# Altium project hexbot_LED.PrjPcb
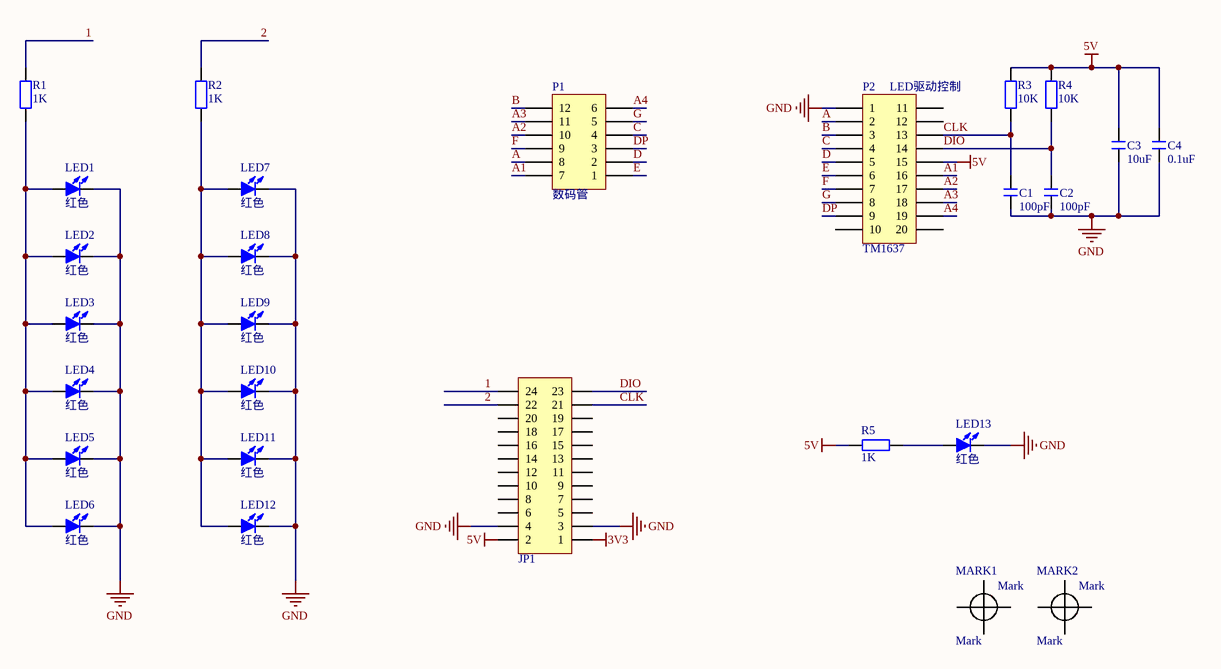
[diagram p0: hexbot_LED.SchDoc]
1 sheet, 27 parts. Net scope: global (net labels, ports and power ports of the same name join across sheets).
Board file: hexbot_LED.PcbDoc

## Sheet hexbot_LED.SchDoc
size A4

### Parts
C1  100pF  [C 0603_L]
C2  100pF  [C 0603_L]
C3  10uF  [C 0603_L]
C4  0.1uF  [C 0603_L]
JP1  Header 2X11  [HDR2.54-WI-2x12P]  (value not drawn)
LED1  红色  [LED 0603R]
LED2  红色  [LED 0603R]
LED3  红色  [LED 0603R]
LED4  红色  [LED 0603R]
LED5  红色  [LED 0603R]
LED6  红色  [LED 0603R]
LED7  红色  [LED 0603R]
LED8  红色  [LED 0603R]
LED9  红色  [LED 0603R]
LED10  红色  [LED 0603R]
LED11  红色  [LED 0603R]
LED12  红色  [LED 0603R]
LED13  红色  [LED 0603R]
MARK1  Mark  [Mark]  (no BOM)
MARK2  Mark  [Mark]  (no BOM)
P1  数码管  [数码管]
P2  TM1637  [TM1637封装]
R1  1K  [R 0603_L]
R2  1K  [R 0603_L]
R3  10K  [R 0603_L]
R4  10K  [R 0603_L]
R5  1K  [R 0603_L]

### Nets
3V3: JP1.1
5V: C3.2 C4.2 JP1.2 P2.15 R3.2 R4.2 R5.2
GND: C1.1 C2.1 C3.1 C4.1 JP1.3 JP1.4 LED1.2(K) LED2.2(K) LED3.2(K) LED4.2(K) LED5.2(K) LED6.2(K) LED7.2(K) LED8.2(K) LED9.2(K) LED10.2(K) LED11.2(K) LED12.2(K) LED13.2(K) P2.1
1: JP1.24 R1.2
2: JP1.22 R2.2
A: P1.8 P2.2
A1: P1.7 P2.16
A2: P1.10 P2.17
A3: P1.11 P2.18
A4: P1.6 P2.19
B: P1.12 P2.3
C: P1.4 P2.4
CLK: C1.2 JP1.21 P2.13 R3.1
D: P1.2 P2.5
DIO: C2.2 JP1.23 P2.14 R4.1
DP: P1.3 P2.9
E: P1.1 P2.6
F: P1.9 P2.7
G: P1.5 P2.8
NetLED1_1: LED1.1(A) LED2.1(A) LED3.1(A) LED4.1(A) LED5.1(A) LED6.1(A) R1.1
NetLED7_1: LED7.1(A) LED8.1(A) LED9.1(A) LED10.1(A) LED11.1(A) LED12.1(A) R2.1
NetLED13_1: LED13.1(A) R5.1

Not connected (* = marked no-connect by the designer): JP1 5 6 7 8 9 10 11 12 13 14 15 16 17 18 19 20; P2 10 11 12 20

### Notes on the sheet
- (near P2) LED驱动控制

### Library data of the parts
C1-C4 = C: 贴片电容; BOM名称: 无极性贴片电容; 淘宝ID: 封装库来自淘宝 ID：黄晶宝石; 联系售后，技术支持: https://shop463601444.taobao.com; 唯一出售店铺网址: https://shop463601444.taobao.com
JP1 = Header 12X2: 12*2P接插件; 版权归属: 封装库来自淘宝卖家 ID：黄晶宝石; BOM名称: 12*2P接插件; 学习资源: https://shop463601444.taobao.com
LED1-LED13 = LED-SMD: 贴片LED; 版权归属: 封装库来自淘宝 ID：黄晶宝石; BOM名称: 贴片LED; 学习资源: https://shop463601444.taobao.com
P1 = Header 6X2A: Header, 6-Pin, Dual row; LatestRevisionDate: 17-Jul-2002; LatestRevisionNote: Re-released for DXP Platform.; Publisher: Altium Limited
P2 = Header 10X2A: Header, 10-Pin, Dual row; LatestRevisionDate: 17-Jul-2002; LatestRevisionNote: Re-released for DXP Platform.; Publisher: Altium Limited
R1-R5 = R: 贴片电阻; 版权归属: 来自淘宝 ID：黄晶宝石; 封装库来自淘宝卖家 ID：黄晶宝石: 其他店铺购入均为盗版，不享受售后技术支持服务，请立即申请退款; BOM名称: 贴片电阻; 联系售后: https://shop463601444.taobao.com